# Altium schematic sheet My_Sheet (2).SchDoc
size 840 x 594 mm; Address1: Address1; Address2: Address2; Address3: Address3; Address4: Address4; DocumentNumber: АБВГ.123456.001 Э3; SheetNumber: 1; Scale: 1:1; DocumentType: Схема электрическая принципиальная; FirstReferrence: АБВГ.123456.001
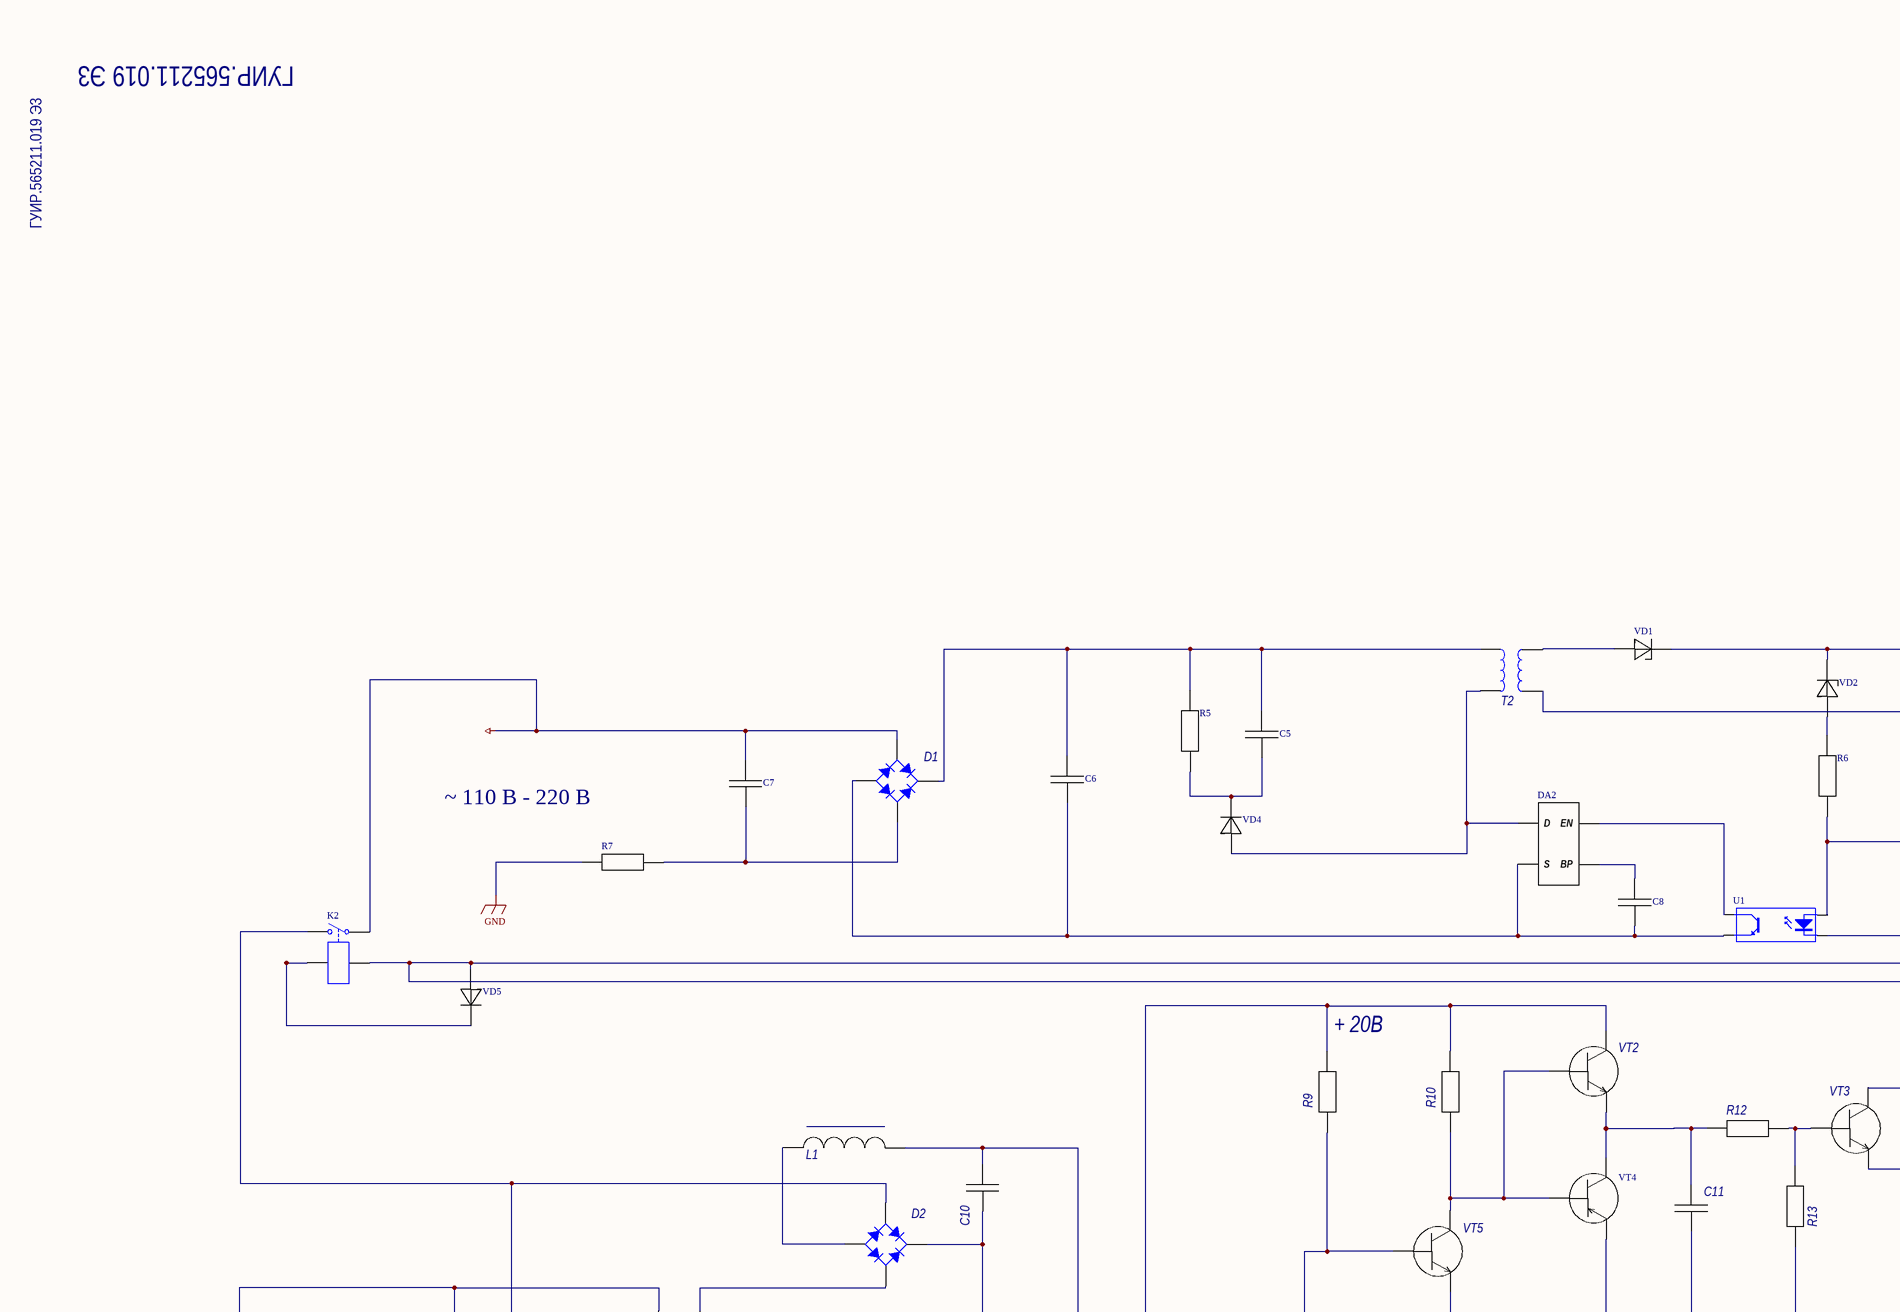
[diagram p0: My_Sheet (2).SchDoc, top left]
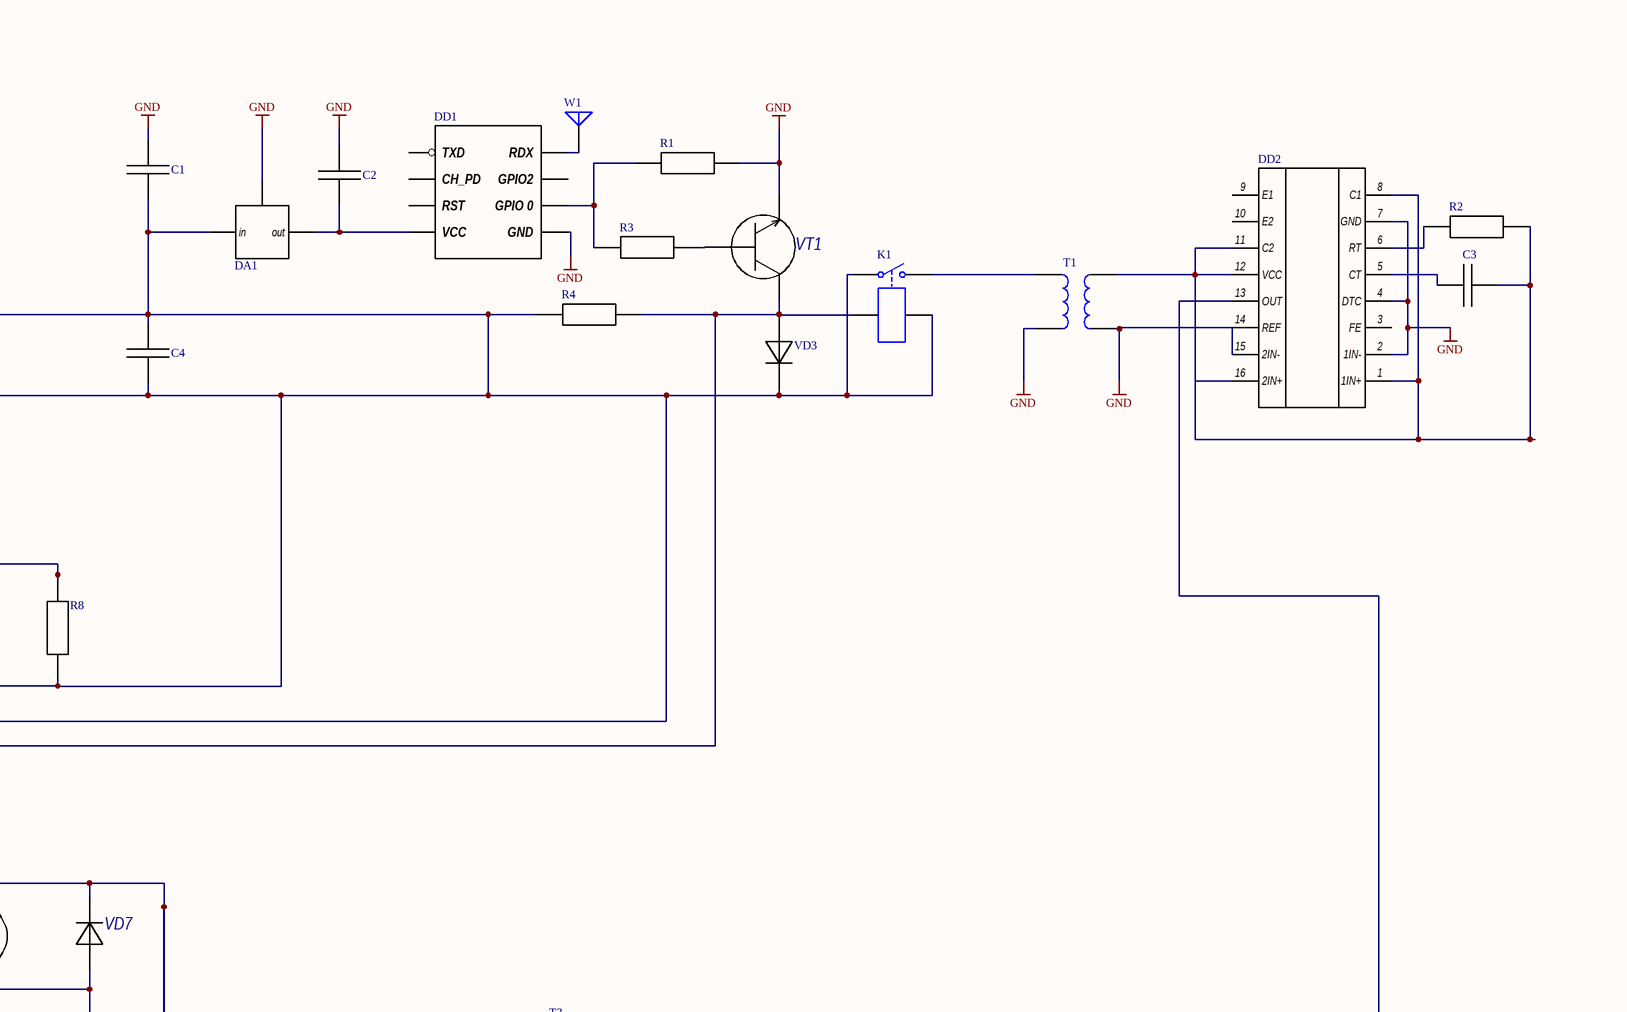
[diagram p1: My_Sheet (2).SchDoc, top right]
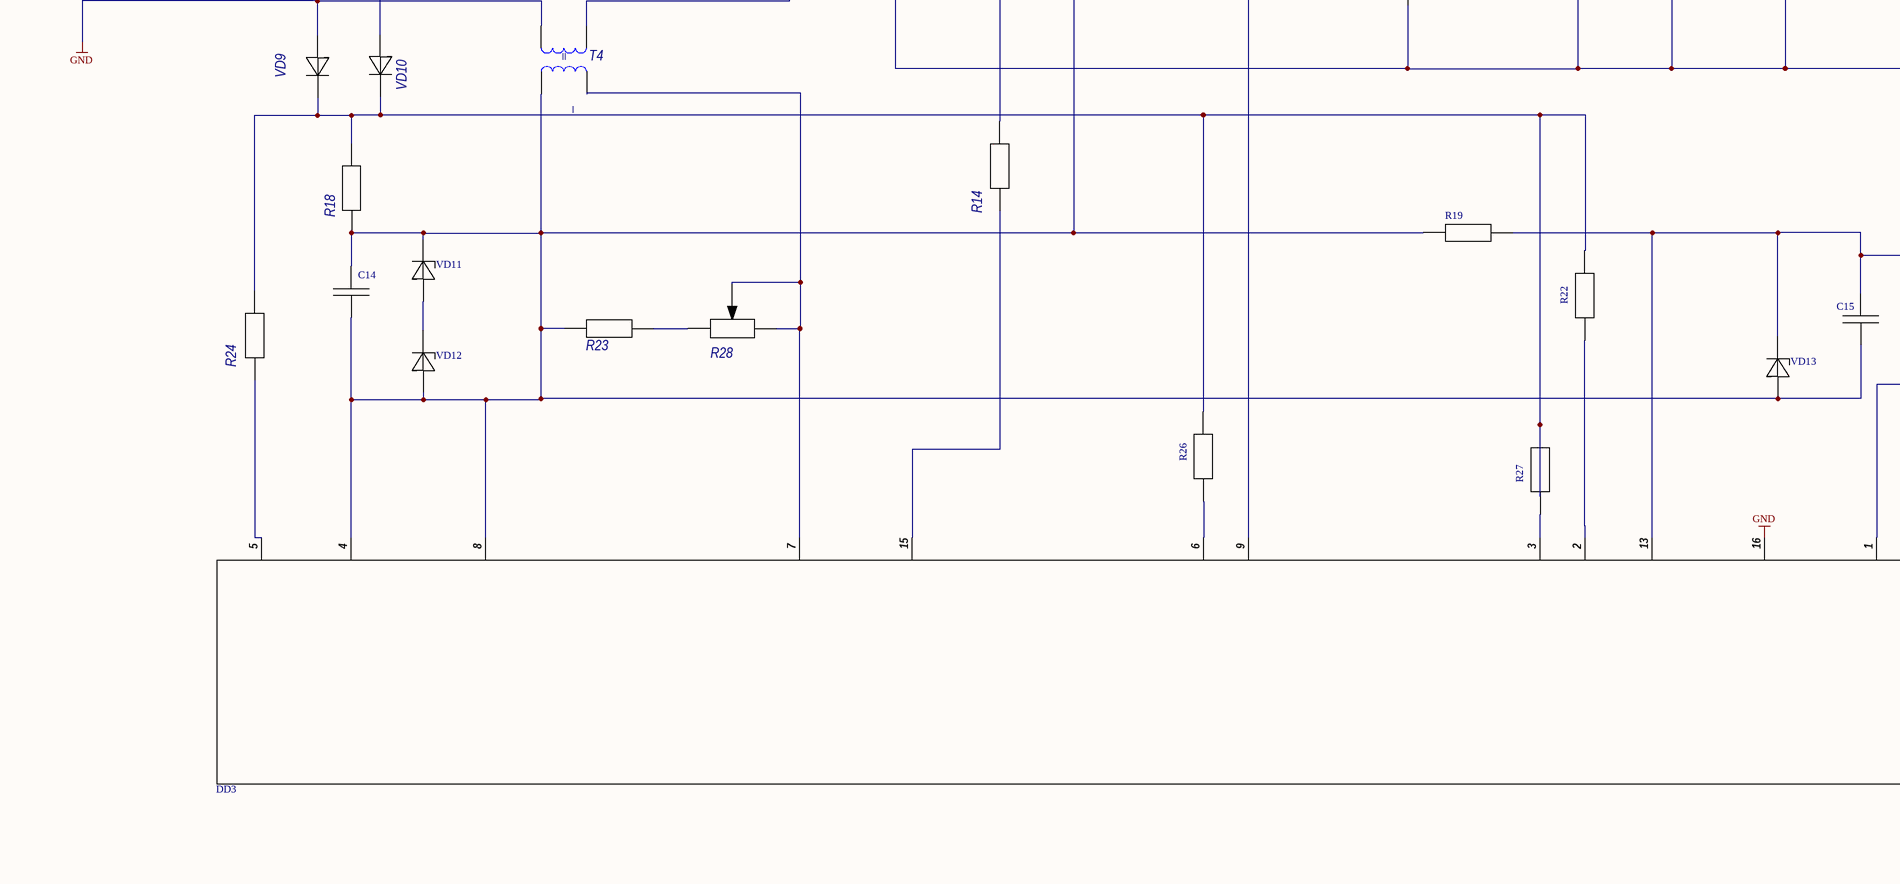
[diagram p2: My_Sheet (2).SchDoc, bottom left]
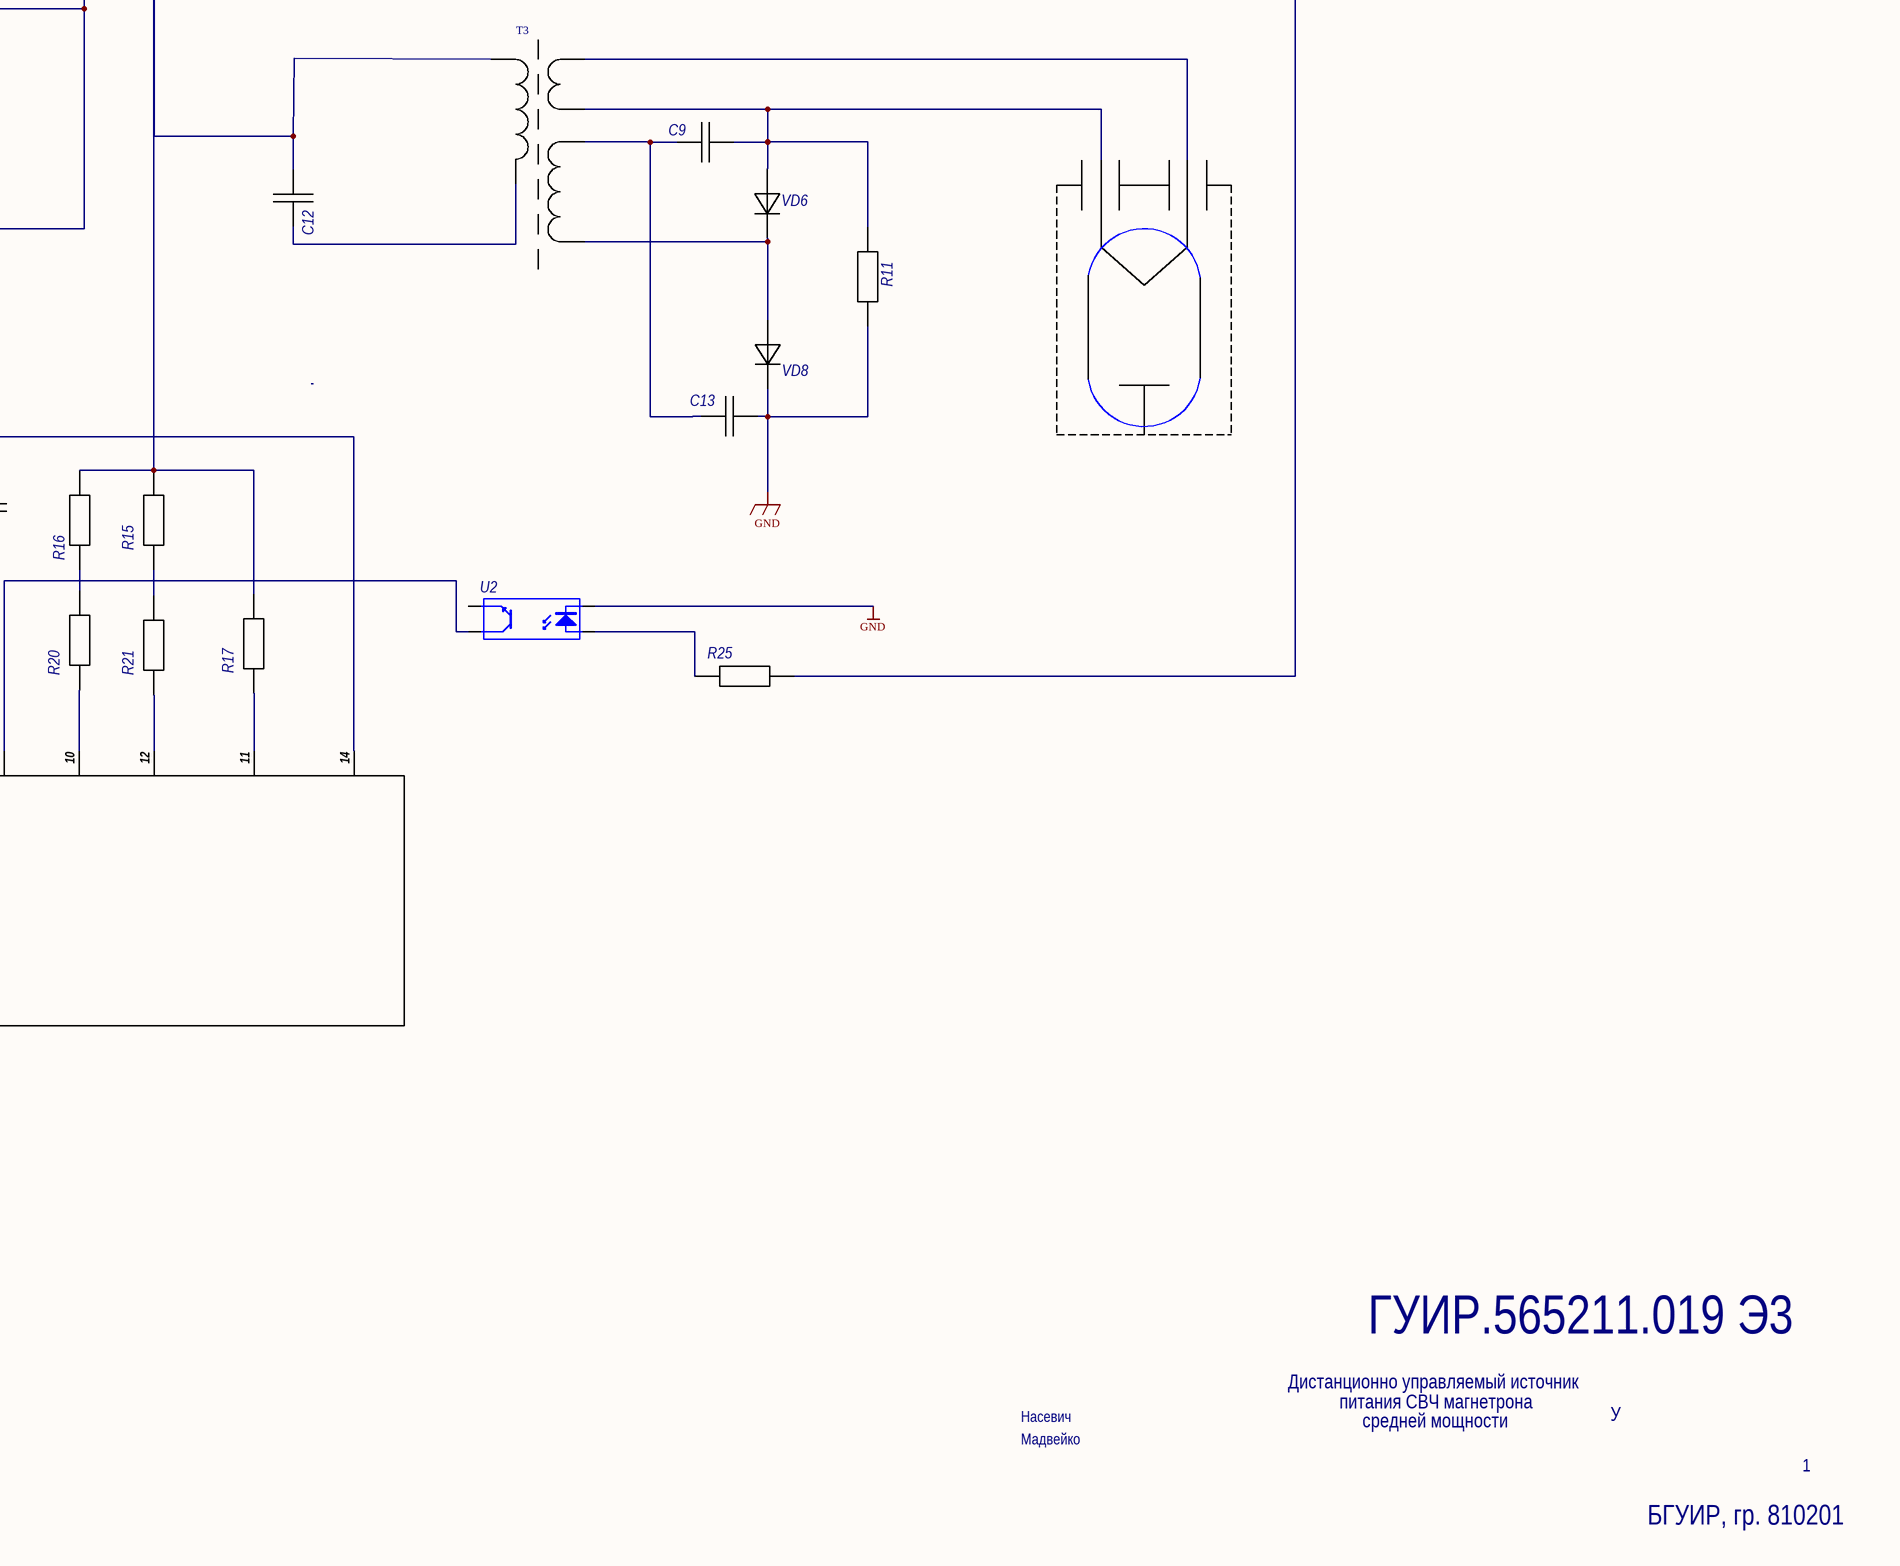
[diagram p3: My_Sheet (2).SchDoc, bottom right]

## Parts
*1  Magnetron  (value not drawn)
C1  Capacitor  [capasitor]  (value not drawn)
C2  Capacitor  [capasitor]  (value not drawn)
C3  Capacitor  [capasitor]  (value not drawn)
C4  Capacitor  [capasitor]  (value not drawn)
C5  Capacitor  [capasitor]  (value not drawn)
C6  Capacitor  [capasitor]  (value not drawn)
C7  Capacitor  [capasitor]  (value not drawn)
C8  Capacitor  [capasitor]  (value not drawn)
C9  Capacitor  [capasitor]  (value not drawn)
C10  4/250V  [capasitor]  (value not drawn)
C11  0.66/500V  [capasitor]  (value not drawn)
C12  0.1/500V  [capasitor]  (value not drawn)
C13  Capacitor  [capasitor]  (value not drawn)
C14  Capacitor  [capasitor]  (value not drawn)
C15  Capacitor  [capasitor]  (value not drawn)
D1  Bridge1  [D-38]  (value not drawn)
D2  Bridge1  [D-38]  (value not drawn)
DA1  КP142ЕН8А  [D2PAK_N]  (value not drawn)
DA2  tiny-switch  [DIP4]  (value not drawn)
DD1  ESP266  [DIP8]  (value not drawn)
DD2  TL494  [DIP16]  (value not drawn)
DD3  driver  [DIP16]  (value not drawn)
K1  Relay-SPST  [RELAY]  (value not drawn)
K2  Relay-SPST  [RELAY]  (value not drawn)
L1  Inductor  [Inductor]  (value not drawn)
R1  Resistor_solo  [RESISTOR]  (value not drawn)
R2  Resistor_solo  [RESISTOR]  (value not drawn)
R3  Resistor_solo  [RESISTOR]  (value not drawn)
R4  Resistor_solo  [RESISTOR]  (value not drawn)
R5  Resistor_solo  [RESISTOR]  (value not drawn)
R6  Resistor_solo  [RESISTOR]  (value not drawn)
R7  Resistor_solo  [RESISTOR]  (value not drawn)
R8  Resistor_solo  [RESISTOR]  (value not drawn)
R9  Resistor_solo  [RESISTOR]  (value not drawn)
R10  Resistor_solo  [RESISTOR]  (value not drawn)
R11  R701  [RESISTOR]  (value not drawn)
R12  10K  [RESISTOR]  (value not drawn)
R13  Resistor_solo  [RESISTOR]  (value not drawn)
R14  200K  [RESISTOR]  (value not drawn)
R15  Resistor_solo  [RESISTOR]  (value not drawn)
R16  Resistor_solo  [RESISTOR]  (value not drawn)
R17  Resistor_solo  [RESISTOR]  (value not drawn)
R18  Resistor_solo  [RESISTOR]  (value not drawn)
R19  240  [RESISTOR]  (value not drawn)
R20  Resistor_solo  [RESISTOR]  (value not drawn)
R21  Resistor_solo  [RESISTOR]  (value not drawn)
R22  110K  [RESISTOR]  (value not drawn)
R23  Resistor_solo  [RESISTOR]  (value not drawn)
R24  Resistor_solo  [RESISTOR]  (value not drawn)
R25  Resistor_solo  [RESISTOR]  (value not drawn)
R26  56K  [RESISTOR]  (value not drawn)
R27  91K  [RESISTOR]  (value not drawn)
R28  Trimmer Resistor  [resistor changable]  (value not drawn)
T1  Trans  [TRANS]  (value not drawn)
T2  Trans  [TRANS]  (value not drawn)
T3  transfomComplicated  [TRF_6]  (value not drawn)
T4  Trans  [TRANS]  (value not drawn)
U1  Optoisolator1  [DIP-4]  (value not drawn)
U2  Optoisolator1  [DIP-4]  (value not drawn)
VD1  Zener diode  [zener dioide]  (value not drawn)
VD2  Zener diode  [zener dioide]  (value not drawn)
VD3  Diode  [zener dioide]  (value not drawn)
VD4  Diode  [zener dioide]  (value not drawn)
VD5  Diode  [zener dioide]  (value not drawn)
VD6  Diode  [zener dioide]  (value not drawn)
VD7  Diode  [zener dioide]  (value not drawn)
VD8  Diode  [zener dioide]  (value not drawn)
VD9  A6V71  [zener dioide]  (value not drawn)
VD10  A6V71  [zener dioide]  (value not drawn)
VD11  Zener diode  [zener dioide]  (value not drawn)
VD12  Zener diode  [zener dioide]  (value not drawn)
VD13  Zener diode  [zener dioide]  (value not drawn)
VT1  N-P-N Transistor_1  [TRANSISTOR]  (value not drawn)
VT2  N-P-N Transistor_1  [TRANSISTOR]  (value not drawn)
VT3  N-P-N Transistor_1  [TRANSISTOR]  (value not drawn)
VT4  P-N-P Transistor  [TRANSISTOR]  (value not drawn)
VT5  N-P-N Transistor_1  [TRANSISTOR]  (value not drawn)
W1  Antenna  [PIN1]  (value not drawn)

## Nets
GND: C1.2 C2.2 C7.2 C13.1 D1.4(C) DA1.3(GND) DD1.5(GND) DD2.2(1IN-) DD2.4(DTC) DD2.7(GND) DD2.14(REF) DD2.15(2IN-) DD3.16 K2.1 R1.2 R7.1 R11.1 T1.2 T1.4 T4.3 U2.2(K) VD8.2 VD9.1 VT1.3
Net*1_5: *1.5 C9.1 R11.2 T3.4 VD6.1
Net*1_6: *1.6 T3.3
NetC1_1: C1.1 C4.1 C4.2 DA1.2(in) K1.1 K1.3 K1.4 K2.3 R4.1 R4.2 R8.1 T2.1 U1.2(K) VD1.2 VD2.2 VD3.1 VD3.2 VD5.1 VT1.1
NetC2_1: C2.1 DA1.1(out) DD1.1(VCC)
NetC3_1: C3.1 DD2.5(CT)
NetC3_2: C3.2 DD2.1(1IN+) DD2.8(C1) DD2.11(C2) DD2.12(VCC) DD2.16(2IN+) R2.2 T1.3
NetC5_1: C5.1 R5.1 VD4.2
NetC5_2: C5.2 C6.2 D1.1(K) R5.2 T2.4
NetC6_1: C6.1 C8.1 D1.3(A) DA2.4(S) U1.3(E)
NetC7_1: C7.1 D1.2(C) R7.2
NetC8_2: C8.2 DA2.3(BP)
NetC9_2: C9.2 C13.2 T3.5
NetC10_1: C10.1 C11.1 D2.1(K) R13.1 VD7.1 VT3.3 VT4.2 VT5.3
NetC10_2: C10.2 L1.2 R14.2
NetC11_2: C11.2 R12.1 VT2.3 VT4.3
NetC12_1: C12.1 T3.2
NetC12_2: C12.2 R15.2 R16.2 R17.2 T3.1 VD7.2 VT3.1
NetC14_1: C14.1 C14.2 C15.1 DD3.4 DD3.8 R9.2 R10.2 R18.1 R19.1 R23.2 T4.1 VD11.2 VD12.1 VD13.1 VT2.1
NetC15_2: C15.2 DD3.13 DD3.14 R19.2 VD13.2
NetD2_2: D2.2(C) T4.4
NetD2_3: D2.3(A) L1.1
NetD2_4: D2.4(C) K2.2 VD10.1
NetDA2_1: DA2.1(D) T2.3 VD4.1
NetDA2_2: DA2.2(EN) U1.4(C)
NetDD1_6: DD1.6(GPIO_0) R1.1 R3.1
NetDD1_8: DD1.8(RDX) W1.1(A)
NetDD2_6: DD2.6(RT) R2.1
NetDD2_13: DD2.13(OUT) R25.2
NetDD3_1: DD3.1 U2.4(C)
NetDD3_2: DD3.2 R22.1
NetDD3_3: DD3.3 R27.1
NetDD3_5: DD3.5 R24.1
NetDD3_6: DD3.6 R26.1
NetDD3_7: DD3.7 R28.2 R28.3 T4.2
NetDD3_9: DD3.9 R9.1 VT5.2
NetDD3_10: DD3.10 R20.1
NetDD3_11: DD3.11 R17.1
NetDD3_12: DD3.12 R21.1
NetDD3_15: DD3.15 R14.1
NetK1_2: K1.2 T1.1
NetK2_4: K2.4 VD5.2
NetR3_2: R3.2 VT1.2
NetR6_1: R6.1 R8.2 U1.1(A)
NetR6_2: R6.2 VD2.1
NetR10_1: R10.1 VT2.2 VT4.1 VT5.1
NetR12_2: R12.2 R13.2 VT3.2
NetR15_1: R15.1 R21.2
NetR16_1: R16.1 R20.2
NetR18_2: R18.2 R22.2 R24.2 R26.2 R27.2 VD9.2 VD10.2
NetR23_1: R23.1 R28.1
NetR25_1: R25.1 U2.1(A)
NetT2_2: T2.2 VD1.1
NetT3_6: T3.6 VD6.2 VD8.1
NetVD11_1: VD11.1 VD12.2

Not connected (* = marked no-connect by the designer): DD1 2(RST) 3(CH_PD) 4(TXD) 7(GPIO2); DD2 3(FE) 9(E1) 10(E2); U2 3(E)

## Notes on the sheet
- ГУИР.565211.019 Э3
- ~ 110 В - 220 В
- (near R9) + 20B
- (near T4) II
- (near T4) I
- Дистанционно управляемый источник
- питания СВЧ магнетрона
- Насевич
- Мадвейко
- средней мощности
- У
- 1
- БГУИР, гр. 810201
- Перв. примен.
- Справ. №
- Подп. и дата
- Инв. № дубл.
- Взам. инв. №
- Разраб.
- Изм.
- Лист
- № докум.
- Подп.
- Дата
- Лит.
- Масса
- Масштаб
- Пров.
- Т.контр.
- Листов
- Инв. № подл.
- Утв.
- Н.контр.
- 2.106-A1
- Формат А1

## Library data of the parts
C1-C15 = Capacitor: *
D1 D2 = Bridge1: Full Wave Diode Bridge; Published: 8-Jun-2000; LatestRevisionDate: 29-May-2009; LatestRevisionNote: Sch pins A & K swapped.; DatasheetVersion: E2732B; PackageReference: D-38; Publisher: Altium Limited; PackageDescription: Bridge Rectifier; 4 Terminals; Body 9.4 x 9.4 mm (typ); Pitch 5.08 mm
K1 K2 = Relay-SPST: Single-Pole Single-Throw Relay; Published: 24-Mar-1999; LatestRevisionDate: 17-Jul-2002; LatestRevisionNote: Re-released for DXP Platform.; PackageReference: MODULE4; Publisher: Altium Limited
L1 = Inductor: *
R1-R27 = Resistor_solo: *
R28 = Trimmer Resistor: *
T1 T2 T4 = Trans: Transformer; Published: 24-Mar-1999; LatestRevisionDate: 08-Jul-2005; LatestRevisionNote: Mech Layer 1 removed.; PackageReference: TRANS; Publisher: Altium Limited; PackageDescription: Transformer; 4 Leads
U1 U2 = Optoisolator1: 4-Pin Phototransistor Optocoupler; Published: 24-Mar-1999; LatestRevisionDate: 04-Mar-2005; LatestRevisionNote: Sch pins 3 & 4 Swapped.; DatasheetVersion: Nov-2003; PackageReference: DIP-4; Publisher: Altium Limited
VD1 VD2 VD11-VD13 = Zener diode: *
VD3-VD10 = Diode: *
VT1-VT3 VT5 = N-P-N Transistor_1: *
VT4 = P-N-P Transistor: *
W1 = Antenna: Generic Antenna; Published: 24-Mar-1999; LatestRevisionDate: 17-Jul-2002; LatestRevisionNote: Re-released for DXP Platform.; PackageReference: PIN1; Publisher: Altium Limited